# EAGLE design ARDUINO_3V_TTL_INTERFACE_2_PI (EAGLE 9.3.1)
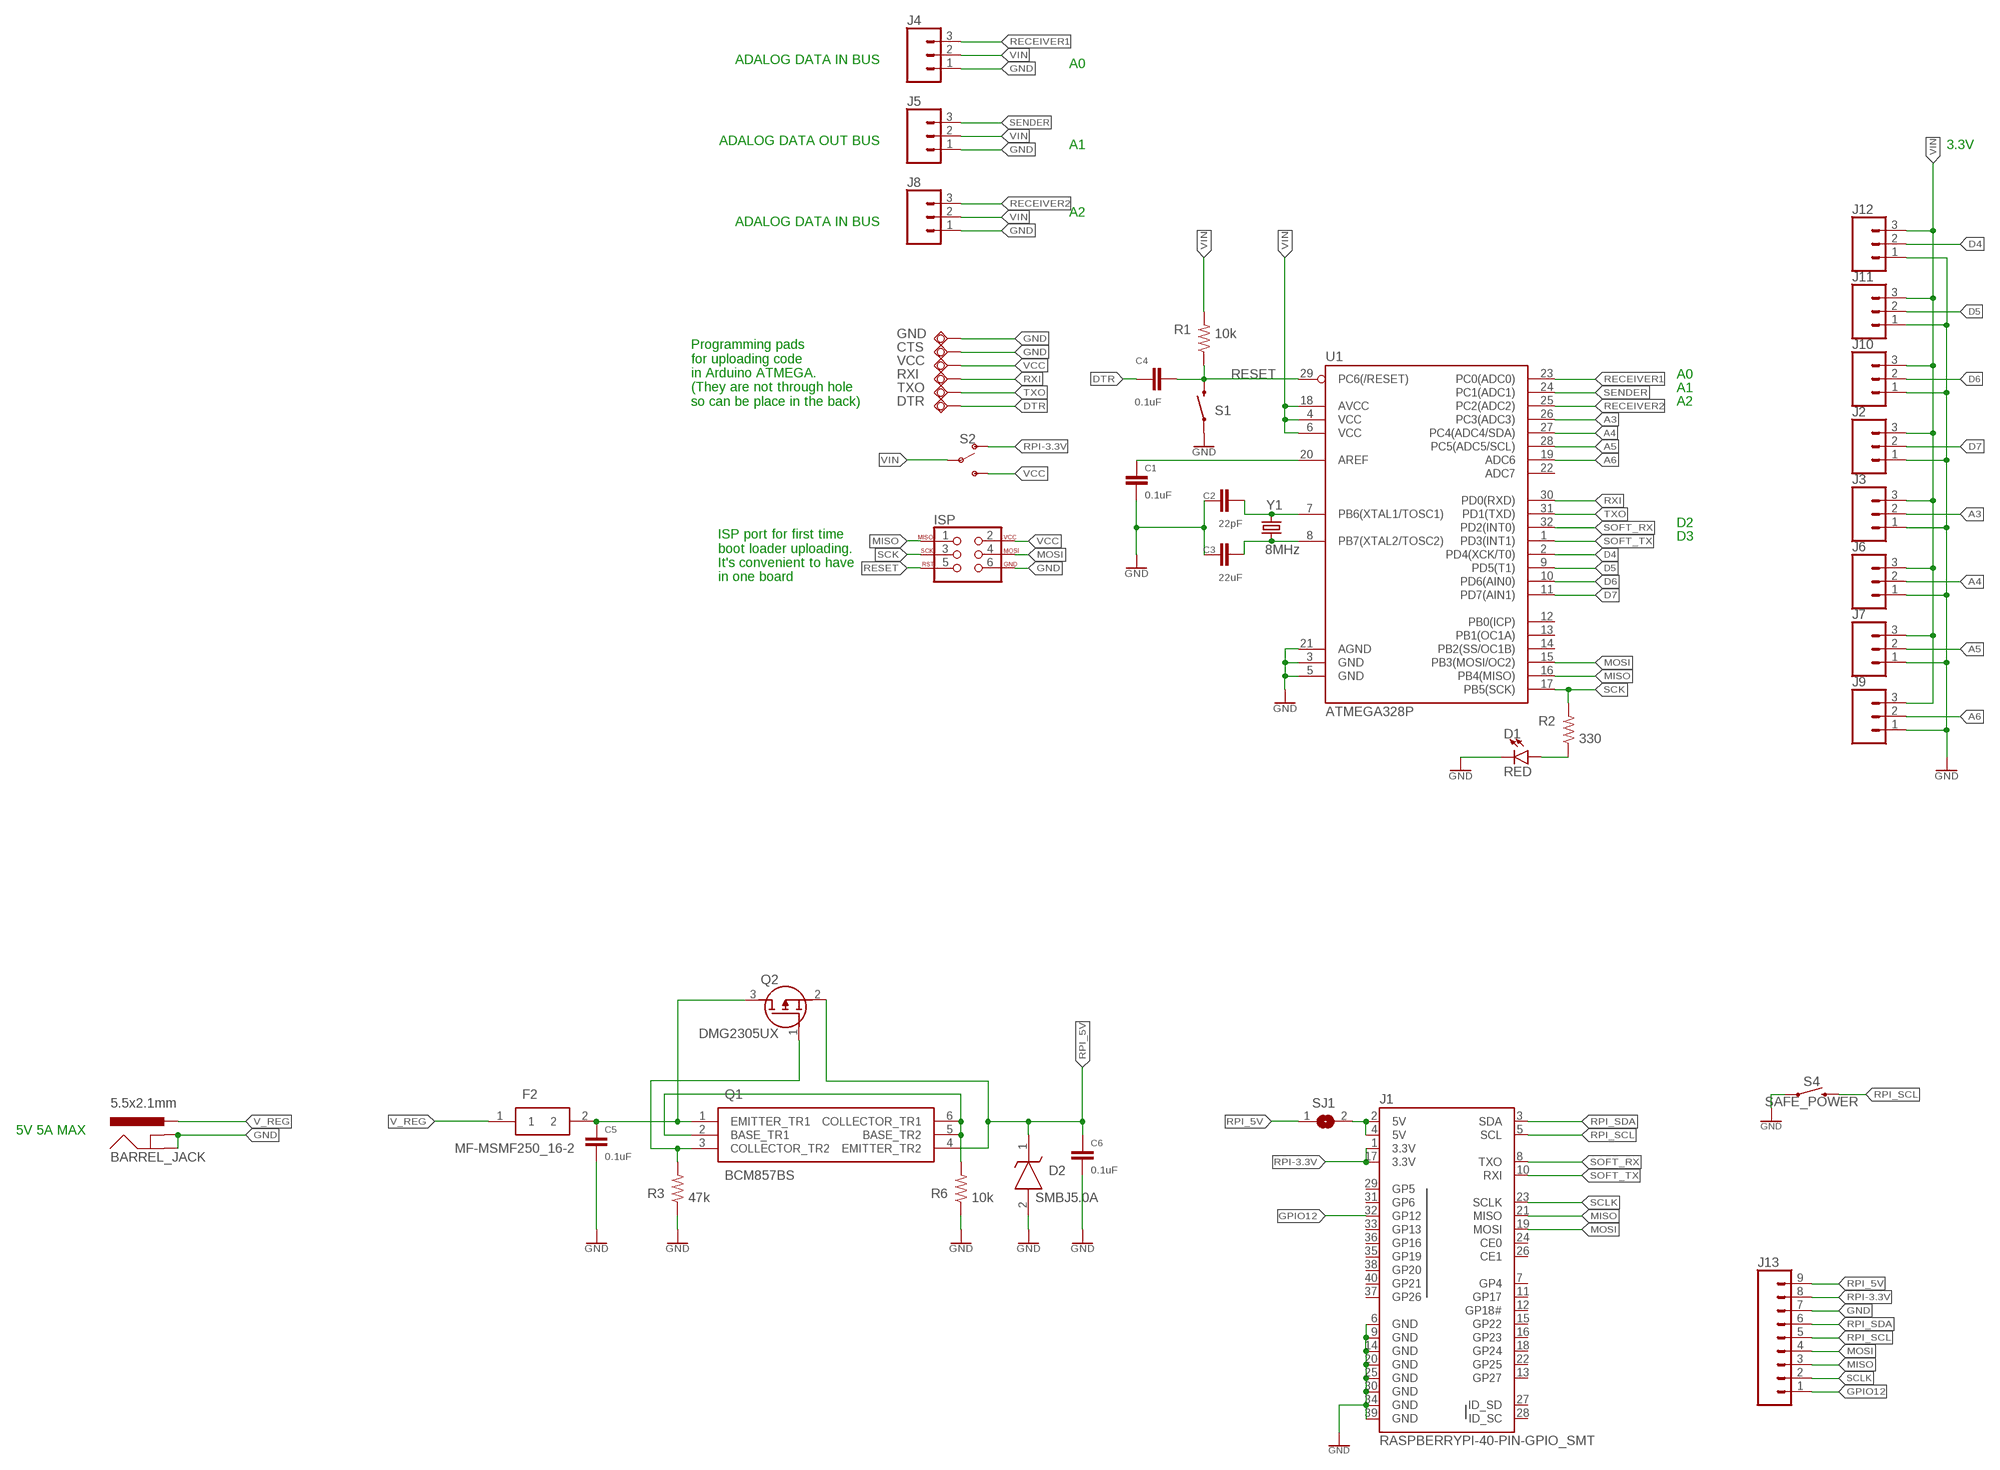
[diagram p0: schematic, sheet 1]

## Parts
BARREL_JACK  5.5x2.1mm  POWER_JACKSMD  [POWER_JACK_SMD]
C1  0.1uF  0.1UF-0603-100V-10%  [0603]
C2  22pF  0.1UF-0603-100V-10%  [0603]
C3  22uF  0.1UF-0603-100V-10%  [0603]
C4  0.1uF  0.1UF-0603-100V-10%  [0603]
C5  0.1uF  0.1UF-0603-100V-10%  [0603]
C6  0.1uF  0.1UF-0603-100V-10%  [0603]
CTS  TPSQB1,27  [B1,27]
D1  RED  LED-GREEN0603  [LED-0603]
D2  SMBJ5.0A  SMBJ5.0A-E3_52  [DIOM5436X244N]
DTR  TPSQB1,27  [B1,27]
F2  MF-MSMF250_16-2  [FUSC4632X160N]
GND  TPSQB1,27  [B1,27]
ISP  AVR_SPI_PROG_3X2NS  [2X3-NS]
J1  RASPBERRYPI-40-PIN-GPIO_SMT  [2X20_SHROUDED_SMT]
J2  CONN_03  [1X03]
J3  CONN_03  [1X03]
J4  CONN_03SMD  [1X03-1MM-RA]
J5  CONN_03SMD  [1X03-1MM-RA]
J6  CONN_03  [1X03]
J7  CONN_03  [1X03]
J8  CONN_03SMD  [1X03-1MM-RA]
J9  CONN_03  [1X03]
J10  CONN_03  [1X03]
J11  CONN_03  [1X03]
J12  CONN_03  [1X03]
J13  CONN_09  [1X09]
Q1  BCM857BS  [SOT65P210X110-6N]
Q2  DMG2305UX  DMG2305UXQ-7  [SOT96P240X102-3N]
R1  10k  10KOHM-0603-1/10W-1%  [0603]
R2  330  10KOHM-0603-1/10W-1%  [0603]
R3  47k  10KOHM-0603-1/10W-1%  [0603]
R6  10k  10KOHM-0603-1/10W-1%  [0603]
RXI  TPSQB1,27  [B1,27]
S1  RESET  MOMENTARY-SWITCH-SPST-SMD-4.6X2.8MM  [TACTILE_SWITCH_SMD_4.6X2.8MM]
S2  SWITCH-SPDT-SMD-RIGHT-ANGLE  [SWITCH_SPST_SMD_A]
S4  SAFE_POWER  MOMENTARY-SWITCH-SPST-PTH-12MM  [TACTILE_SWITCH_PTH_12MM]
SJ1  SJ  [SJ]
TXO  TPSQB1,27  [B1,27]
U1  ATMEGA328P  ATMEGA328P_TQFP  [TQFP32-08]
VCC  TPSQB1,27  [B1,27]
Y1  8MHz  CRYSTAL-8MHZSMD-HC49UP  [HC49UP]

## Nets
A3: J3.2 U1.26(PC3(ADC3))
A4: J6.2 U1.27(PC4(ADC4/SDA))
A5: J7.2 U1.28(PC5(ADC5/SCL))
A6: J9.2 U1.19(ADC6)
D4: J12.2 U1.2(PD4(XCK/T0))
D5: J11.2 U1.9(PD5(T1))
D6: J10.2 U1.10(PD6(AIN0))
D7: J2.2 U1.11(PD7(AIN1))
DTR: C4.1 DTR.TP
GND: BARREL_JACK.GND(GNDBREAK) BARREL_JACK.P$4(GND) C1.2 C2.1 C3.1 C5.2 C6.2 CTS.TP D1.C D2.2(A) GND.TP ISP.6 J1.6(GND) J1.9(GND) J1.14(GND) J1.20(GND) J1.25(GND) J1.30(GND) J1.34(GND) J1.39(GND) J2.1 J3.1 J4.1 J5.1 J6.1 J7.1 J8.1 J9.1 J10.1 J11.1 J12.1 J13.7 R3.1 R6.1 S1.1 S1.2 S4.1 U1.3(GND) U1.5(GND) U1.21(AGND)
GPIO12: J1.32(GP12) J13.1
MISO: ISP.1 J1.21(MISO) J13.3 U1.16(PB4(MISO))
MOSI: ISP.4 J1.19(MOSI) J13.4 U1.15(PB3(MOSI/OC2))
N$1: C1.1 U1.20(AREF)
N$2: J1.2(5V) J1.4(5V) SJ1.2
N$3: D1.A R2.1
N$4: Q1.3(COLLECTOR_TR2) Q2.1(G) R3.2
N$6: Q1.2(BASE_TR1) Q1.5(BASE_TR2) Q1.6(COLLECTOR_TR1) R6.2
N$7: C2.2 U1.7(PB6(XTAL1/TOSC1)) Y1.2
N$8: C3.2 U1.8(PB7(XTAL2/TOSC2)) Y1.1
RECEIVER1: J4.3 U1.23(PC0(ADC0))
RECEIVER2: J8.3 U1.25(PC2(ADC2))
RESET: C4.2 ISP.5 R1.1 S1.3 S1.4 U1.29(PC6(/RESET))
RPI-3.3V: J1.1(3.3V) J1.17(3.3V) J13.8 S2.1(O)
RPI_5V: C6.1 D2.1(K) J13.9 Q1.4(EMITTER_TR2) Q2.2(S) SJ1.1
RPI_SCL: J1.5(SCL) J13.5 S4.3
RPI_SDA: J1.3(SDA) J13.6
RXI: RXI.TP U1.30(PD0(RXD))
SCK: ISP.3 R2.2 U1.17(PB5(SCK))
SCLK: J1.23(SCLK) J13.2
SENDER: J5.3 U1.24(PC1(ADC1))
SOFT_RX: J1.8(TXO) U1.32(PD2(INT0))
SOFT_TX: J1.10(RXI) U1.1(PD3(INT1))
TXO: TXO.TP U1.31(PD1(TXD))
V_REG: BARREL_JACK.VIN0(PWR) C5.1 F2.1 F2.2 Q1.1(EMITTER_TR1) Q2.3(D)
VCC: ISP.2 S2.3(S) VCC.TP
VIN: J2.3 J3.3 J4.2 J5.2 J6.3 J7.3 J8.2 J9.3 J10.3 J11.3 J12.3 R1.2 S2.2(P) U1.4(VCC) U1.6(VCC) U1.18(AVCC)
Unconnected: J1.7(GP4) J1.11(GP17) J1.12(GP18#) J1.13(GP27) J1.15(GP22) J1.16(GP23) J1.18(GP24) J1.22(GP25) J1.24(CE0) J1.26(CE1) J1.27(ID_SD) J1.28(ID_SC) J1.29(GP5) J1.31(GP6) J1.33(GP13) J1.35(GP19) J1.36(GP16) J1.37(GP26) J1.38(GP20) J1.40(GP21) U1.12(PB0(ICP)) U1.13(PB1(OC1A)) U1.14(PB2(SS/OC1B)) U1.22(ADC7)

## Notes on the sheet
- ADALOG DATA IN BUS
- A0
- ADALOG DATA OUT BUS
- A1 | 3.3V
- ADALOG DATA IN BUS | A2
- A0
- A1
- Programming pads
  for uploading code
  in Arduino ATMEGA.
  (They are not through hole
  so can be place in the back)
- A2
- D2
- D3
- ISP port for first time
  boot loader uploading.
  It's convenient to have
  in one board
- 5V 5A MAX

## Library data of the parts
BARREL_JACK = 3-5-pin-smd:POWER_JACK: Power Jack Connector This is the standard 5.5mm barrel jack for power. The PTH is the most common, proven, reliable, footprint. The Slot footprint only works if the mill layer is transmitted to the PCB fab house so be warned. Here are the connectors we sell at SparkFun: DC Barrel Power Jack/Connector <https://www.sparkfun.com/products/119> (PRT-00119) DC Barrel Power Jack/Connector (SMD) <https://www.sparkfun.com/products/12748> (PRT-12748) DC Barrel Jack Adapter - Breadboard Compatible <https://www.sparkfun.com/products/10811> (PRT-10811) It is used on this SparkFun product (and many, many others): SparkFun RedBoard - Programmed with Arduino <https://www.sparkfun.com/products/12757> (DEV-12757) Also, if you need a mating power supply or connector, please check these out: Wall Adapter Power Supply - 9VDC 650mA <https://www.sparkfun.com/products/298> (TOL-00298) DC Barrel Jack Adapter - Male <https://www.sparkfun.com/products/10287> (PRT-10287); PROD_ID: CONN-08106; SF_ID: PRT-12748; VALUE: 5.5x2.1mm Barrel
C1 C4-C6 = SparkFun-Capacitors:0.1UF: 0.1µF ceramic capacitors A capacitor is a passive two-terminal electrical component used to store electrical energy temporarily in an electric field.; PROD_ID: CAP-08390
C2 C3 = SparkFun-Capacitors:0.1UF: 0.1µF ceramic capacitors A capacitor is a passive two-terminal electrical component used to store electrical energy temporarily in an electric field.; PROD_ID: CAP-08390; VALUE: 0.1uF
CTS DTR GND RXI TXO VCC = testpad:TPSQ: Test pad
D1 = SparkFun-LED:LED-GREEN: Green SMD LED Used in manufacturing of various products at SparkFun Packages: 0603 - SMD 0603 package [Product Link] <http://www.futureelectronics.com/en/technologies/semiconductors/optoelectronics/leds/Pages/9894312-LTST-C190GKT.aspx?CrossPart=HSMG-C190&IM=0> LilyPad 1206 - SMD1206 LilyPad package [Product Link] <http://www.futureelectronics.com/en/Technologies/Product.aspx?ProductID=IN150NGHARVATEKCORPORATION2049943&IM=0> 1206 - SMD1206 package [Product Link] <http://www.futureelectronics.com/en/technologies/semiconductors/optoelectronics/leds/Pages/8315665-LTST-C150KGKT.aspx?IM=0> 1206 Bottom Mount -SMD 1206 Bottom Mount [Product Link] <http://www.digikey.com/product-detail/en/lite-on-inc/LTST-C230KGKT/160-1456-1-ND/386854> SparkFun Products: Pro Mini 328 -5V <https://www.sparkfun.com/products/821> RedBoard <https://www.sparkfun.com/products/12757> MP3 Trigger <https://www.sparkfun.com/products/13720> Makey Makey <https://www.sparkfun.com/products/11076>; PROD_ID: DIO-00821; VALUE: GREEN
D2 = SMBJ5.0A-E3_52:SMBJ5.0A-E3_52: Vishay SMBJ5.0A-E3/52, Uni-Directional TVS Diode, 600W, 2-Pin DO-214AA Source: Datasheet <https://www.vishay.com/docs/88392/smbj.pdf>; ALLIED_NUMBER: 70217303; ALLIED_PRICE-STOCK: https://www.alliedelec.com/generalsemiconductor-vishay-smbj5-0a-e3-52/70217303/; DESCRIPTION: Vishay SMBJ5.0A-E3/52, Uni-Directional TVS Diode, 600W, 2-Pin DO-214AA; HEIGHT: 2.44mm; MANUFACTURER_NAME: Vishay; MANUFACTURER_PART_NUMBER: SMBJ5.0A-E3/52; MOUSER_PART_NUMBER: 625-SMBJ5.0A-E3; MOUSER_PRICE-STOCK: https://www.mouser.com/Search/Refine.aspx?Keyword=625-SMBJ5.0A-E3; RS_PART_NUMBER: 1652507; RS_PRICE-STOCK: http://uk.rs-online.com/web/p/products/1652507
F2 = MF-MSMF250_16-2:MF-MSMF250_16-2: BOURNS - MF-MSMF250/16-2 - FUSE, RESETTABLE PTC, 16V, 2.5A, 1812 Source: Datasheet <http://www.mouser.com/datasheet/2/54/fmsmf-772347.pdf>; DESCRIPTION: BOURNS - MF-MSMF250/16-2 - FUSE, RESETTABLE PTC, 16V, 2.5A, 1812; HEIGHT: 1.6mm; MANUFACTURER_NAME: Bourns; MANUFACTURER_PART_NUMBER: MF-MSMF250/16-2; MOUSER_PART_NUMBER: 652-MF-MSMF250/16-2
ISP = SparkFun-Connectors:AVR_SPI_PROG_3X2: AVR ISP 6 Pin This is the reduced ISP connector for AVR programming. Common on Arduino. This footprint will take up less PCB space and can be used with a 10-pin to 6-pin adapter such as SKU: BOB-08508 **Special note about "TEST_POINT" package. The stop mask is on the top side, so if you want your programming test points to be on the bottom of your board, make sure to place this package on the bottom side of the board. This also ensure that the orientation to program from the bottom side will be correct. SparkFun Products: SparkFun ISP Pogo Adapter <https://www.sparkfun.com/products/11591> - NS Tiny AVR Programmer <https://www.sparkfun.com/products/11801> -PTH
J1 = SparkFun-Connectors:RASPBERRYPI-40-PIN-GPIO: Raspberry Pi GPIO Header 2x20 pin connector, as found on B, B+, A+ models. Both shrouded PTH and SMT versions available. SparkFun Products: GPIO Shrouded Header <https://www.sparkfun.com/products/13054>- PTH SparkFun Pi Wedge (Preassembled) <https://www.sparkfun.com/products/13717>; PROD_ID: CONN-13143
J2-J12 = SparkFun-Connectors:CONN_03: Multi connection point. Often used as Generic Header-pin footprint for 0.1 inch spaced/style header connections On any of the 0.1 inch spaced packages, you can populate with these: Break Away Headers - Straight <https://www.sparkfun.com/products/116> (PRT-00116) Break Away Male Headers - Right Angle <https://www.sparkfun.com/products/553> (PRT-00553) Female Headers <https://www.sparkfun.com/products/115> (PRT-00115) Break Away Headers - Machine Pin <https://www.sparkfun.com/products/117> (PRT-00117) Break Away Female Headers - Swiss Machine Pin <https://www.sparkfun.com/products/743> (PRT-00743) Stackable Header - 3 Pin (Female, 0.1") <https://www.sparkfun.com/products/13875> (PRT-13875) For SCREWTERMINALS and SPRING TERMINALS visit here: Screw Terimnals on SparkFun.com <https://www.sparkfun.com/search/results?term=Screw+Terminals> (5mm/3.5mm/2.54mm spacing) This device is also useful as a general connection point to wire up your design to another part of your project. Our various solder wires solder well into these plated through hole pads. Hook-Up Wire - Assortment (Stranded, 22 AWG) <https://www.sparkfun.com/products/11375> (PRT-11375) Hook-Up Wire - Assortment (Solid Core, 22 AWG) <https://www.sparkfun.com/products/11367> (PRT-11367) View the entire wire category on our website here <https://www.sparkfun.com/categories/141> Special notes: Molex polarized connector foot print use with SKU : PRT-08232 with associated crimp pins and housings.
J13 = SparkFun-Connectors:CONN_09: Multi connection point. Often used as Generic Header-pin footprint for 0.1 inch spaced/style header connections On any of the 0.1 inch spaced packages, you can populate with these: Break Away Headers - Straight <https://www.sparkfun.com/products/116> (PRT-00116) Break Away Male Headers - Right Angle <https://www.sparkfun.com/products/553> (PRT-00553) Female Headers <https://www.sparkfun.com/products/115> (PRT-00115) Break Away Headers - Machine Pin <https://www.sparkfun.com/products/117> (PRT-00117) Break Away Female Headers - Swiss Machine Pin <https://www.sparkfun.com/products/743> (PRT-00743) For SCREWTERMINALS and SPRING TERMINALS visit here: Screw Terimnals on SparkFun.com <https://www.sparkfun.com/search/results?term=Screw+Terminals> (5mm/3.5mm/2.54mm spacing) This device is also useful as a general connection point to wire up your design to another part of your project. Our various solder wires solder well into these plated through hole pads. Hook-Up Wire - Assortment (Stranded, 22 AWG) <https://www.sparkfun.com/products/11375> (PRT-11375) Hook-Up Wire - Assortment (Solid Core, 22 AWG) <https://www.sparkfun.com/products/11367> (PRT-11367) View the entire wire category on our website here <https://www.sparkfun.com/categories/141> Special notes: Molex polarized connector foot print use with SKU : PRT-08231 with associated crimp pins and housings. 1MM SMD Version SKU: PRT-10208 NOTES ON THE VARIANTS LOCK and LOCK_LONGPADS... This footprint was designed to help hold the alignment of a through-hole component (i.e. 6-pin header) while soldering it into place. You may notice that each hole has been shifted either up or down by 0.005 of an inch from it's more standard position (which is a perfectly straight line). This slight alteration caused the pins (the squares in the middle) to touch the edges of the holes. Because they are alternating, it causes a "brace" to hold the component in place. 0.005 has proven to be the perfect amount of "off-center" position when using our standard breakaway headers. Although looks a little odd when you look at the bare footprint, once you have a header in there, the alteration is very hard to notice. Also,if you push a header all the way into place, it is covered up entirely on the bottom side.
Q1 = BCM857BS:BCM857BS: NEXPERIA - BCM857BS - TRANSISTOR, MATCHED, SOT-363 Source: Datasheet <https://assets.nexperia.com/documents/data-sheet/BCM857BV_BS_DS.pdf>; DESCRIPTION: NEXPERIA - BCM857BS - TRANSISTOR, MATCHED, SOT-363; HEIGHT: 1.1mm; MANUFACTURER_NAME: Nexperia; MANUFACTURER_PART_NUMBER: BCM857BS; MOUSER_PART_NUMBER: N/A; MOUSER_PRICE-STOCK: https://www.mouser.com/Search/Refine.aspx?Keyword=N%2FA
Q2 = DMG2305UXQ-7:DMG2305UXQ-7: MOSFET MOSFET BVDSS Source: Datasheet <https://componentsearchengine.com/Datasheets/1/DMG2305UXQ-7.pdf>; DESCRIPTION: MOSFET MOSFET BVDSS; HEIGHT: 1.025mm; MANUFACTURER_NAME: Diodes Inc.; MANUFACTURER_PART_NUMBER: DMG2305UXQ-7; MOUSER_PART_NUMBER: 621-DMG2305UXQ-7; MOUSER_PRICE-STOCK: https://www.mouser.com/Search/Refine.aspx?Keyword=621-DMG2305UXQ-7
R1 R6 = SparkFun-Resistors:10KOHM: 10kΩ resistor A resistor is a passive two-terminal electrical component that implements electrical resistance as a circuit element. Resistors act to reduce current flow, and, at the same time, act to lower voltage levels within circuits. - Wikipedia; PROD_ID: RES-00824
R2 R3 = SparkFun-Resistors:10KOHM: 10kΩ resistor A resistor is a passive two-terminal electrical component that implements electrical resistance as a circuit element. Resistors act to reduce current flow, and, at the same time, act to lower voltage levels within circuits. - Wikipedia; PROD_ID: RES-00824; VALUE: 10k
S1 = SparkFun-Switches:MOMENTARY-SWITCH-SPST: Momentary Switch (Pushbutton) - SPST Normally-open (NO) SPST momentary switches (buttons, pushbuttons). Variants PTH-12MM - 12mm square, through-hole Momentary Pushbutton Switch - 12mm Square <https://www.sparkfun.com/products/9190> (COM-09190) PTH-6.0MM, PTH-6.0MM-KIT - 6.0mm square, through-hole Mini Pushbutton Switch <https://www.sparkfun.com/products/97> (COM-00097) KIT package intended for soldering kit's - only one side of pads' copper is exposed. PTH-RIGHT-ANGLE-KIT - Right-angle, through-hole Right Angle Tactile Button <https://www.sparkfun.com/products/10791> - Used on SparkFun BigTime Watch Kit <https://www.sparkfun.com/products/11734> SMD-12MM - 12mm square, surface-mount Tactile Button - SMD (12mm) <https://www.sparkfun.com/products/12993> (COM-12993) Used on SparkFun PicoBoard <https://www.sparkfun.com/products/11888> SMD-4.5MM - 4.5mm Square Trackball Switch Used on SparkFun Blackberry Trackballer Breakout <https://www.sparkfun.com/products/13169> SMD-4.6MMX2.8MM - 4.60mm x 2.80mm, surface mount Used on SparkFun SAMD21 Mini Breakout <https://www.sparkfun.com/products/13664> SMD-5.2MM, SMD-5.2-REDUNDANT - 5.2mm square, surface-mount Mini Pushbutton Switch - SMD <https://www.sparkfun.com/products/8720> (COM-08720) Used on Arduino Pro Mini <https://www.sparkfun.com/products/11114> REDUNDANT package connects both switch circuits together SMD-6.0X3.5MM - 6.0 x 3.5mm, surface mount Momentary Reset Switch SMD <https://www.sparkfun.com/products/8229> (COM-08229) SMD-6.2MM-TALL - 6.2mm square, surface mount Tactile Button - SMD (6mm) <https://www.sparkfun.com/products/12992> Used on SparkFun Digital Sandbox <https://www.sparkfun.com/products/12651> SMD-RIGHT-ANGLE - Right-angle, surface mount Used on SparkFun Block for Intel® Edison - Arduino <https://www.sparkfun.com/products/13036>; PROD_ID: SWCH-13065
S2 = SparkFun-Switches:SWITCH-SPDT: Single Pole, Double Throw (SPDT) Switch Single-pole, double-throw (SPDT) switch. Variant Overview SMD-AYZ0202 Surface Mount DPDT Switch <https://www.sparkfun.com/products/597> (COM-00597) Used on e.g. LilyPad Arduino USB - ATmega32U4 Board <https://www.sparkfun.com/products/12049> PTH-11.6X4.0MM SPDT Mini Power Switch <https://www.sparkfun.com/products/102> (COM-00102) Used on e.g. SparkFun Simon Says - Through-Hole Soldering Kit <https://www.sparkfun.com/products/10547> (KIT-10547) PTH-11.6X4.0MM-KIT KIT version of SPDT Mini Power Switch - Simplifies soldering by removing tStop of switch pins - only one side can be soldered. PTH-11.6X4.0MM-LOCK LOCK version of SPDT Mini Power Switch - Offset pins hold switch in place for easier soldering. SMD-RIGHT-ANGLE Surface Mount Right Angle Switch <https://www.sparkfun.com/products/10860> (COM-10860) Used on e.g. SparkFun ESP8266 Thing <https://www.sparkfun.com/products/13231>; PROD_ID: SWCH-10651; SF_SKU: COM-10860
S4 = SparkFun-Switches:MOMENTARY-SWITCH-SPST: Momentary Switch (Pushbutton) - SPST Normally-open (NO) SPST momentary switches (buttons, pushbuttons). Variants PTH-12MM - 12mm square, through-hole Momentary Pushbutton Switch - 12mm Square <https://www.sparkfun.com/products/9190> (COM-09190) PTH-6.0MM, PTH-6.0MM-KIT - 6.0mm square, through-hole Mini Pushbutton Switch <https://www.sparkfun.com/products/97> (COM-00097) KIT package intended for soldering kit's - only one side of pads' copper is exposed. PTH-RIGHT-ANGLE-KIT - Right-angle, through-hole Right Angle Tactile Button <https://www.sparkfun.com/products/10791> - Used on SparkFun BigTime Watch Kit <https://www.sparkfun.com/products/11734> SMD-12MM - 12mm square, surface-mount Tactile Button - SMD (12mm) <https://www.sparkfun.com/products/12993> (COM-12993) Used on SparkFun PicoBoard <https://www.sparkfun.com/products/11888> SMD-4.5MM - 4.5mm Square Trackball Switch Used on SparkFun Blackberry Trackballer Breakout <https://www.sparkfun.com/products/13169> SMD-4.6MMX2.8MM - 4.60mm x 2.80mm, surface mount Used on SparkFun SAMD21 Mini Breakout <https://www.sparkfun.com/products/13664> SMD-5.2MM, SMD-5.2-REDUNDANT - 5.2mm square, surface-mount Mini Pushbutton Switch - SMD <https://www.sparkfun.com/products/8720> (COM-08720) Used on Arduino Pro Mini <https://www.sparkfun.com/products/11114> REDUNDANT package connects both switch circuits together SMD-6.0X3.5MM - 6.0 x 3.5mm, surface mount Momentary Reset Switch SMD <https://www.sparkfun.com/products/8229> (COM-08229) SMD-6.2MM-TALL - 6.2mm square, surface mount Tactile Button - SMD (6mm) <https://www.sparkfun.com/products/12992> Used on SparkFun Digital Sandbox <https://www.sparkfun.com/products/12651> SMD-RIGHT-ANGLE - Right-angle, surface mount Used on SparkFun Block for Intel® Edison - Arduino <https://www.sparkfun.com/products/13036>; PROD_ID: SWCH-09185; SF_SKU: COM-09190
SJ1 = jumper:SJ: SMD solder JUMPER
U1 = SparkFun-IC-Microcontroller:ATMEGA328P_TQFP: Popular 328P in QFP Storefront component: ATmega328 - TQFP <https://www.sparkfun.com/products/13448> (COM-13448) Datasheet <http://www.sparkfun.com/datasheets/Components/SMD/ATMega328.pdf> SparkFun Products SparkFun RedBoard - Programmed with Arduino <https://www.sparkfun.com/products/12757> (DEV-12757) Arduino Pro Mini 328 - 5V/16MHz <https://www.sparkfun.com/products/11113> (DEV-11113) Arduino Pro Mini 328 - 3.3V/8MHz <https://www.sparkfun.com/products/11114> (DEV-11114) SparkFun OpenLog <https://www.sparkfun.com/products/13712> (DEV-13712) SparkFun MicroView - OLED Arduino Module <https://www.sparkfun.com/products/12923> (DEV-12923) SparkFun Digital Sandbox <https://www.sparkfun.com/products/12651> (DEV-12651) SparkFun PicoBoard <https://www.sparkfun.com/products/11888> (WIG-11888) Arduino Fio <https://www.sparkfun.com/products/10116> (DEV-10116) LilyPad Arduino 328 Main Board <https://www.sparkfun.com/products/13342> (DEV-13342) SparkFun RedStick <https://www.sparkfun.com/products/13741> (DEV-13741) LilyPad MP3 <https://www.sparkfun.com/products/11013> (DEV-11013) LilyPad Arduino SimpleSnap <https://www.sparkfun.com/products/10941> (DEV-10941) SparkFun Stepoko <https://www.sparkfun.com/products/13899> (ROB-13899) SparkFun Geiger Counter <https://www.sparkfun.com/products/11345> (SEN-11345) SparkFun EL Sequencer <https://www.sparkfun.com/products/12781> (COM-12781) Arduino Pro 328 - 5V/16MHz <https://www.sparkfun.com/products/10915> (DEV-10915) CryptoCape <https://www.sparkfun.com/products/12773> (DEV-12773) SparkFun IR Thermometer Evaluation Board - MLX90614 <https://www.sparkfun.com/products/10740> (SEN-10740) SparkFun RedBot Mainboard <https://www.sparkfun.com/products/12097> (ROB-12097) Arduino Pro 328 - 3.3V/8MHz <https://www.sparkfun.com/products/10914> (DEV-10914) SparkFun Block for Intel® Edison - Arduino <https://www.sparkfun.com/products/13036> (DEV-13036) SparkFun Simon Says - Surface Mount Soldering Kit <https://www.sparkfun.com/products/10935> (KIT-10935) SparkFun 7-Segment Serial Display - Red <https://www.sparkfun.com/products/11441> (COM-11441) SparkFun 7-Segment Serial Display - White <https://www.sparkfun.com/products/11629> (COM-11629) SparkFun 7-Segment Serial Display - Yellow <https://www.sparkfun.com/products/11443> (COM-11443) SparkFun 7-Segment Serial Display - Kelly Green <https://www.sparkfun.com/products/11440> (COM-11440) SparkFun 7-Segment Serial Display - Blue <https://www.sparkfun.com/products/11442> (COM-11442) SparkFun OpenSegment Serial Display - 20mm (Blue) <https://www.sparkfun.com/products/11647> (COM-11647) SparkFun OpenSegment Serial Display - 20mm (Green) <https://www.sparkfun.com/products/11646> (COM-11646) SparkFun OpenSegment Serial Display - 20mm (White) <https://www.sparkfun.com/products/11648> (COM-11648) SparkFun OpenSegment Serial Display - 20mm (Red) <https://www.sparkfun.com/products/11644> (COM-11644) SparkFun OpenSegment Serial Display - 20mm (Yellow) <https://www.sparkfun.com/products/11645> (COM-11645) SparkFun OpenSegment Shield <https://www.sparkfun.com/products/13190> (DEV-13190); PROD_ID: IC-09069; VALUE: ATMEGA328P_TQFP
Y1 = SparkFun-Clocks:CRYSTAL-8MHZ: 8MHz Crystal Datasheet Example <http://www.futureelectronics.com/en/technologies/electromechanical/timing-devices/crystals/Pages/6008189-ABM3B-8.000MHZ-B2-T.aspx?IM=0> Frequency: 8MHz Frequency Tolerance: ±20ppm Load Capacitance: 18pF SparkFun Products: Pro Micro -3.3V/8MHz <https://www.sparkfun.com/products/12587> WAV Trigger <https://www.sparkfun.com/products/13660>; PROD_ID: XTAL-11706

## Board
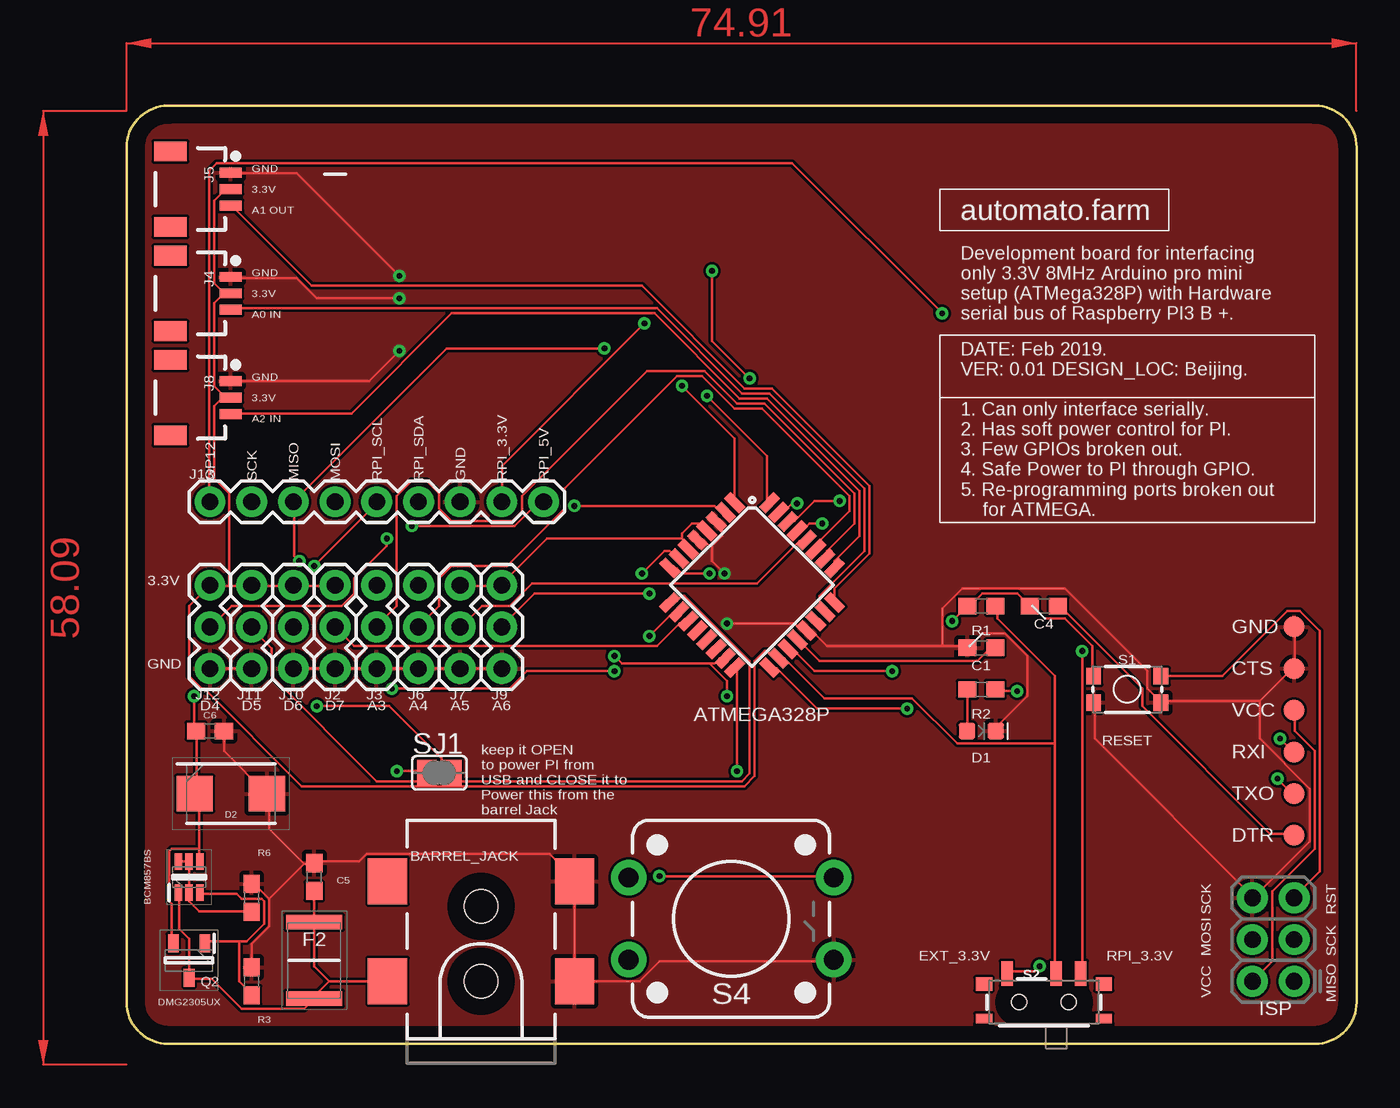
[diagram p1: board, top side]
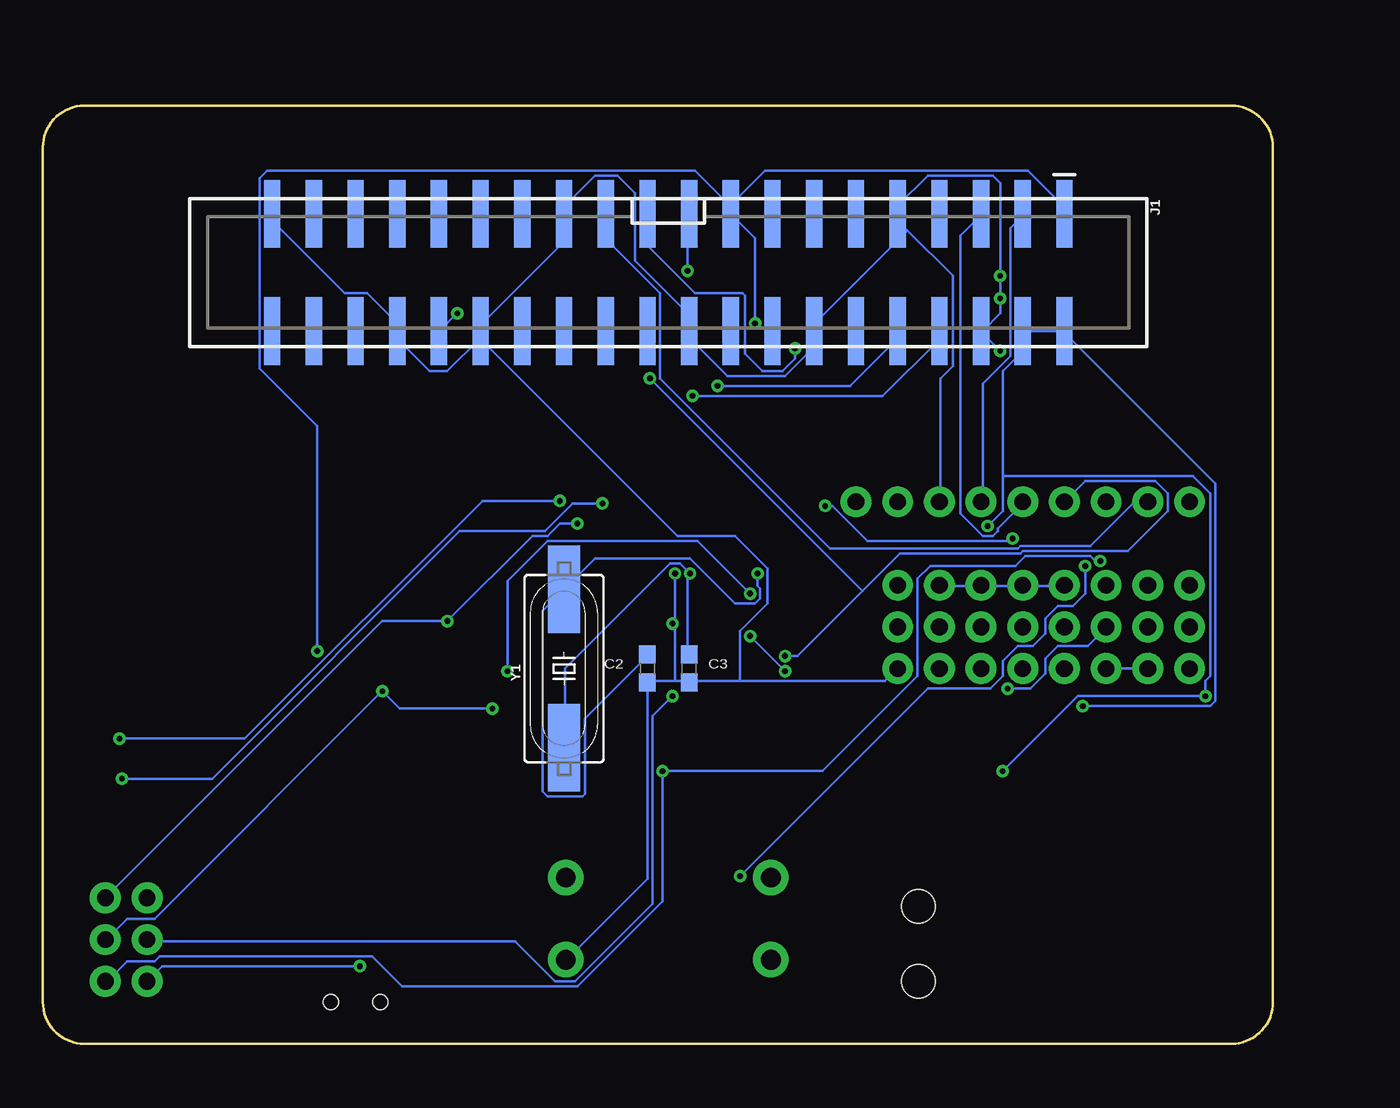
[diagram p2: board, bottom side, seen from below]

Size 74.93 x 57.15 mm. Coordinates in mm from the lower left corner, seen from the top.
Outline: 0,54.61 0,2.54 arc90 2.54,0 72.39,0 arc90 74.93,2.54 74.93,54.61 arc90 72.39,57.15 2.54,57.15 arc90 0,54.61
Copper layers (1*16): Top 0.035mm / dielectric 1.5mm / Bottom 0.035mm
Design rules "default": minimum track width 6mil, minimum drill 0.35mm, track to track 6mil, track to pad 6mil, pad to pad 6mil, via to via 6mil, smd to smd 6mil, copper to edge 40mil, drill to drill 6mil, minimum pad ring 10mil, minimum via ring 8mil, stop-mask expansion 4mil, vias tented up to drill 0mil, thermal gap 10mil

### Footprints (pad centres in the part's own frame; a part is rotated, then mirrored left to right if it is on the bottom)
POWER_JACK_SMD = smd 2.8 x 2.4: GND 0,-5.7; P$4 6.1,-5.7; VIN0 0,5.7; VIN1 6.1,5.7 | hole 2.032: 0,0; 4.572,0
0603 = smd 1.1 x 1: 1 -0.85,0; 2 0.85,0
B1,27 = smd 1.27 x 1.27: TP 0,0
LED-0603 = smd 1 x 1: A -0.877,0; C 0.877,0
DIOM5436X244N = smd 2.2 x 2.15: 1 -2.2,0; 2 2.2,0
FUSC4632X160N = smd 0.89 x 3.43: 1 -2.325,0; 2 2.325,0
2X3-NS = drill 1.016 pad 1.88: 1 -2.54,-1.27; 2 -2.54,1.27; 3 0,-1.27; 4 0,1.27; 5 2.54,-1.27; 6 2.54,1.27
2X20_SHROUDED_SMT = smd 4.14 x 0.991: 1 -3.569,24.13; 2 3.569,24.13; 3 -3.569,21.59; 4 3.569,21.59; 5 -3.569,19.05; 6 3.569,19.05; 7 -3.569,16.51; 8 3.569,16.51; 9 -3.569,13.97; 10 3.569,13.97; 11 -3.569,11.43; 12 3.569,11.43; 13 -3.569,8.89; 14 3.569,8.89; 15 -3.569,6.35; 16 3.569,6.35; 17 -3.569,3.81; 18 3.569,3.81; 19 -3.569,1.27; 20 3.569,1.27; 21 -3.569,-1.27; 22 3.569,-1.27; 23 -3.569,-3.81; 24 3.569,-3.81; 25 -3.569,-6.35; 26 3.569,-6.35; 27 -3.569,-8.89; 28 3.569,-8.89; 29 -3.569,-11.43; 30 3.569,-11.43; 31 -3.569,-13.97; 32 3.569,-13.97; 33 -3.569,-16.51; 34 3.569,-16.51; 35 -3.569,-19.05; 36 3.569,-19.05; 37 -3.569,-21.59; 38 3.569,-21.59; 39 -3.569,-24.13; 40 3.569,-24.13
1X03 = drill 1.016 pad 1.88: 1 0,0; 2 2.54,0; 3 5.08,0
1X03-1MM-RA = smd 0.6 x 1.35: 1 -1,0; 2 0,0; 3 1,0 | smd 1.2 x 2: NC1 2.3,-3.675; NC2 -2.3,-3.675
1X09 = drill 1.016 pad 1.88: 1 0,0; 2 2.54,0; 3 5.08,0; 4 7.62,0; 5 10.16,0; 6 12.7,0; 7 15.24,0; 8 17.78,0; 9 20.32,0
SOT65P210X110-6N = smd 1 x 0.45: 1 -0.95,0.65; 2 -0.95,0; 3 -0.95,-0.65; 4 0.95,-0.65; 5 0.95,0; 6 0.95,0.65
SOT96P240X102-3N = smd 1.1 x 0.65: 1 -1.05,0.96; 2 -1.05,-0.96; 3 1.05,0
TACTILE_SWITCH_SMD_4.6X2.8MM = smd 0.9 x 1: 1 -2.05,-0.8; 2 2.05,-0.8; 3 2.05,0.8; 4 -2.05,0.8
SWITCH_SPST_SMD_A = smd 0.7 x 1.5: 1 -2.25,-1.75; 2 -0.75,-1.75; 3 2.25,-1.75 | smd 1 x 0.6: GND1 -3.65,1; GND3 3.65,1 | smd 1 x 0.8: GND2 -3.65,-1.1; GND4 3.65,-1.1 | hole 0.9: -1.5,0; 1.5,0
TACTILE_SWITCH_PTH_12MM = drill 1.2 pad 2.159: 1 6.25,-2.5; 2 -6.25,-2.5; 3 6.25,2.5; 4 -6.25,2.5
SJ = smd 1.168 x 1.6: 1 -0.762,0; 2 0.762,0
TQFP32-08 = smd 1.27 x 0.559: 1 -4.293,2.8; 2 -4.293,2; 3 -4.293,1.2; 4 -4.293,0.4; 5 -4.293,-0.4; 6 -4.293,-1.2; 7 -4.293,-2; 8 -4.293,-2.8; 17 4.293,-2.8; 18 4.293,-2; 19 4.293,-1.2; 20 4.293,-0.4; 21 4.293,0.4; 22 4.293,1.2; 23 4.293,2; 24 4.293,2.8 | smd 0.559 x 1.27: 9 -2.8,-4.293; 10 -2,-4.293; 11 -1.2,-4.293; 12 -0.4,-4.293; 13 0.4,-4.293; 14 1.2,-4.293; 15 2,-4.293; 16 2.8,-4.293; 25 2.8,4.293; 26 2,4.293; 27 1.2,4.293; 28 0.4,4.293; 29 -0.4,4.293; 30 -1.2,4.293; 31 -2,4.293; 32 -2.8,4.293
HC49UP = smd 5.334 x 1.93: 1 -4.826,0; 2 4.826,0

### Placement (x,y rotation side)
BARREL_JACK  21.59,3.81 90 top
C1  52.07,24.13 180 top
C2  38.1,22.86 90 bottom
C3  35.56,22.86 90 bottom
C4  55.88,26.67 180 top
C5  11.43,10.16 90 top
C6  5.08,19.05 0 top
CTS  71.12,22.86 0 top
D1  52.07,19.05 0 top
D2  6.35,15.24 0 top
DTR  71.12,12.7 0 top
F2  11.43,5.08 90 top
GND  71.12,25.4 0 top
ISP  69.85,6.35 90 top
J1  36.83,46.99 270 bottom
J2  12.7,22.86 90 top
J3  15.24,22.86 90 top
J4  6.35,45.72 270 top
J5  6.35,52.07 270 top
J6  17.78,22.86 90 top
J7  20.32,22.86 90 top
J8  6.35,39.37 270 top
J9  22.86,22.86 90 top
J10  10.16,22.86 90 top
J11  7.62,22.86 90 top
J12  5.08,22.86 90 top
J13  5.08,33.02 0 top
Q1  3.81,10.16 90 top
Q2  3.81,5.08 270 top
R1  52.07,26.67 0 top
R2  52.07,21.59 0 top
R3  7.62,3.81 270 top
R6  7.62,8.89 270 top
RXI  71.12,17.78 0 top
S1  60.96,21.59 0 top
S2  55.88,2.54 180 top
S4  36.83,7.62 0 top
SJ1  19.05,16.51 0 top
TXO  71.12,15.24 0 top
U1  38.1,27.94 315 top
VCC  71.12,20.32 0 top
Y1  43.18,22.86 90 bottom

### Tracks (layer width: path | path; a pad name or v marks a point on that pad's centre or on a via)
A3
  Top 0.152: U1.26 42.67,29.57 42.67,30.02 44.35,31.7 44.35,33.53 38.86,39.01 37.19,39.01 35.2,41 31.7,41 24.08,33.38 24.08,32.46 23.47,31.85 19.81,31.85 19.05,32.61 19.05,33.53 18.29,34.29 17.37,34.29 16.46,33.38 16.46,26.67 15.24,25.45 J3.2
A4
  Top 0.152: J6.2 19.05,26.67 19.05,28.35 19.81,29.11 23.16,29.11 26.67,32.61 26.67,33.83 33.53,40.69 35.05,40.69 37.03,38.71 38.71,38.71 44.04,33.38 44.04,32.46 42.06,30.48 42.06,30.18 U1.27
A5
  Top 0.152: U1.28 41.3,30.63 41,30.63 38.41,28.04 24.69,28.04 23.32,26.67 21.64,26.67 20.42,25.45 J7.2
A6  (via drill 0.35)
  Top 0.152: v46.63,22.71 41.91,22.71 40.69,23.93 40.39,23.93 U1.19 | v31.85,27.43 24.84,27.43 22.86,25.45 J9.2
  Bottom 0.152: v46.63,22.71 46.63,28.19 44.2,30.63 35.05,30.63 v31.85,27.43
D4  (via drill 0.35)
  Top 0.152: v27.28,32.77 35.81,32.77 36.12,32.46 36.42,32.46 U1.2 | v15.85,30.79 15.85,30.33 13.87,28.35 13.87,27.43 13.11,26.67 6.4,26.67 5.18,25.45 J12.2
  Bottom 0.152: v27.28,32.77 26.82,32.77 24.69,30.63 16,30.63 v15.85,30.79
D5
  Top 0.152: U1.9 33.22,26.98 33.53,26.98 33.83,27.28 33.98,27.28 37.95,23.32 37.95,16.46 37.49,16 15.24,16 8.84,22.4 8.84,24.08 7.62,25.3 J11.2
D6  (via drill 0.35)
  Top 0.152: v31.85,24.84 33.22,26.21 33.53,26.21 U1.10 | v29.72,22.71 24.38,22.71 23.32,21.64 v16.15,21.64
  Bottom 0.152: v29.72,22.71 v31.85,24.84 | v16.15,21.64 14.78,21.64 13.87,22.55 13.87,23.47 13.11,24.23 11.28,24.23 10.21,25.3 J10.2
D7
  Top 0.152: J2.2 13.87,24.23 32.31,24.23 33.68,25.6 34.14,25.6 U1.11
DTR
  Top 0.152: C4.1 56.84,26.67 61.87,21.64 61.87,20.57 69.65,12.8 71.02,12.8 DTR.TP
GND  (via drill 0.35)
  Top 0.152: v16.61,42.22 14.78,40.39 6.4,40.39 J8.1 | v16.61,45.41 11.58,45.41 10.36,46.63 6.4,46.63 J4.1 | v16.61,46.79 10.36,53.03 6.4,53.03 J5.1 | 52.12,24.99 53.49,24.99 54.86,23.62 54.86,21.18 53.03,19.36 53.03,19.05 D1.C | 51.36,24.23 C1.2 51.21,24.23 49.68,24.23 | 49.68,24.23 42.67,24.23 41.76,25.15 41.45,25.15 U1.21 41.3,25.3 41,25.3 40.69,25.6 v36.58,25.6 | 69.04,20.88 63.09,20.88 S1.2 62.94,20.88 62.18,21.64 62.18,22.71 57.15,27.74 50.9,27.74 49.68,26.52 49.68,24.23 | 69.04,20.88 71.02,22.86 CTS.TP 71.17,22.86 71.17,25.3 GND.TP | S1.1 58.98,20.73 58.98,18.59 68.58,8.99 ISP.6 68.58,8.84 72.08,12.34 72.08,15.54 69.04,18.59 69.04,20.88 | J11.1 J12.1 | J10.1 J2.1 J3.1 J6.1 J7.1 J9.1 | 35.66,30.33 35.51,30.33 35.2,30.63 34.9,30.63 U1.5 | 35.66,30.33 36.27,30.94 36.27,31.39 35.97,31.7 U1.3 | 35.66,30.33 35.66,29.41 v36.42,28.65 | C6.2 5.94,19.05 5.94,17.83 8.53,15.24 D2.2 8.69,15.24 8.69,13.11 10.82,10.97 | R3.1 7.62,6.1 8.69,7.16 8.69,8.84 | 8.69,8.84 7.92,9.6 7.62,9.6 R6.1 | 10.82,10.97 11.43,10.97 C5.2 11.43,11.12 14.17,11.12 14.63,11.58 25.76,11.58 27.28,10.06 BARREL_JACK.P$4 BARREL_JACK.GND 31.24,3.81 32.46,5.03 42.98,5.03 S4.1 | 8.69,8.84 10.82,10.97
  Bottom 0.152: 48.31,42.98 48.31,43.28 J1.30 | 48.31,42.98 50.29,41 51.36,41 53.34,42.98 J1.34 53.34,43.89 55.17,45.72 56.54,45.72 60.96,50.14 J1.39 | J1.30 48.16,43.43 48.16,43.89 43.28,48.77 43.28,50.44 J1.25 43.13,50.6 43.13,51.05 41.3,52.88 39.93,52.88 38.86,51.82 38.86,47.7 35.66,44.5 35.66,43.43 J1.20 35.51,43.28 35.51,42.98 33.22,40.69 29.72,40.69 28.04,42.37 28.04,43.28 J1.14 27.89,43.43 27.89,43.89 22.25,49.53 | v16.61,42.22 17.68,43.28 J1.6 17.68,43.43 16.61,44.5 v16.61,45.41 v16.61,46.79 16.61,52.43 17.07,52.88 21.03,52.88 22.86,51.05 J1.9 22.86,50.14 22.25,49.53 | 22.25,49.53 19.51,46.79 19.51,41.3 20.27,40.54 20.27,33.07 J13.7 | J10.1 J11.1 | 36.42,22.1 38.1,22.1 C2.1 38.1,10.06 42.98,5.18 S4.1 | 36.42,22.1 35.66,22.1 C3.1 35.51,22.1 32.46,22.1 | 32.46,22.1 23.62,22.1 J9.1 | 36.42,22.1 36.42,25.6 | 36.42,25.6 v36.42,28.65 | 36.42,25.6 v36.58,25.6 | 48.31,42.98 36.27,30.94 32.77,30.94 30.79,28.96 30.79,26.82 32.46,25.15 32.46,22.1 | 48.31,42.98 J1.30
  pour Top: 0,57.15 0,0 1.27,0 74.93,0 74.93,3.81 74.93,57.15
GPIO12  (via drill 0.35)
  Top 0.152: v49.68,44.5 40.54,53.65 5.49,53.65 5.03,53.19 5.03,33.07 J13.1
  Bottom 0.152: v49.68,44.5 50.75,43.43 J1.32
MISO  (via drill 0.35)
  Top 0.152: v37.19,16.61 37.19,22.86 U1.16 | v10.52,29.41 10.21,29.72 10.21,32.92 J13.3 19.51,42.37 v29.11,42.37
  Bottom 0.152: ISP.1 71.02,3.81 69.8,5.03 68.12,5.03 67.82,5.33 54.86,5.33 53.03,3.5 42.37,3.5 37.19,8.69 v37.19,16.61 27.43,16.61 21.64,22.4 21.64,28.35 20.88,29.11 15.7,29.11 15.09,29.72 11.12,29.72 10.82,29.41 v10.52,29.41 | J1.21 38.1,48.62 35.2,45.72 32.31,45.72 32.16,45.57 32.16,42.06 31.09,41 29.87,41 29.11,41.76 v29.11,42.37
MOSI  (via drill 0.35)
  Top 0.152: 35.51,23.16 30.18,23.16 v29.72,23.62 | 35.51,23.16 35.81,23.16 36.12,23.47 36.42,23.47 U1.15 | v36.58,21.18 36.58,22.1 35.51,23.16 | v35.66,47.09 35.66,42.82 v37.95,40.54
  Bottom 0.152: v29.72,23.62 28.96,23.62 24.99,27.58 | 24.99,27.58 22.71,29.87 15.39,29.87 15.24,30.02 8.84,30.02 6.4,32.46 6.4,33.53 7.16,34.29 11.43,34.29 J13.4 | v36.58,21.18 37.8,19.96 37.8,8.53 42.52,3.81 43.74,3.81 46.18,6.25 68.58,6.25 ISP.4 | v35.66,47.09 35.66,50.44 J1.19 | 24.99,27.58 v37.95,40.54
N$1
  Top 0.152: C1.1 52.88,24.08 52.58,24.08 51.82,23.32 42.22,23.32 41,24.54 U1.20
N$2  (via drill 0.35)
  Top 0.152: v11.58,20.57 16,20.57 19.2,17.37 19.2,17.22 19.81,16.61 SJ1.2
  Bottom 0.152: v11.58,20.57 3.81,20.57 3.5,20.88 3.5,34.14 12.65,43.28 J1.2 12.8,43.43 15.24,43.43 J1.4
N$3
  Top 0.152: D1.A 51.21,19.05 51.21,21.49 R2.1
N$4
  Top 0.152: 6.86,6.25 4.88,6.25 Q2.1 | 6.86,6.25 7.32,6.25 8.38,7.32 8.38,8.69 8.23,8.84 7.01,8.84 6.71,9.14 4.57,9.14 Q1.3 | 6.86,6.25 6.86,3.81 7.62,3.05 R3.2
N$6
  Top 0.152: Q1.6 3.2,11.12 3.81,11.12 Q1.5 Q1.2 3.81,8.69 4.42,8.08 7.62,8.08 R6.2
N$7  (via drill 0.35)
  Top 0.152: v31.39,28.65 32.77,30.02 33.07,30.02 33.53,29.57 U1.7
  Bottom 0.152: C2.2 38.1,23.62 41.91,19.81 41.91,15.24 42.06,15.09 44.2,15.09 44.5,15.39 44.5,26.36 Y1.2 41.3,29.57 35.51,29.57 32.77,26.82 31.55,26.82 31.24,27.13 31.24,27.74 31.39,27.89 v31.39,28.65
N$8  (via drill 0.35)
  Top 0.152: v35.51,28.65 33.83,28.65 33.53,28.96 33.22,28.96 U1.8
  Bottom 0.152: 35.66,28.65 35.66,28.8 36.12,29.26 36.73,29.26 43.13,22.86 43.13,18.14 Y1.1 | 35.66,28.65 35.66,23.77 C3.2 | 35.66,28.65 v35.51,28.65
RECEIVER1
  Top 0.152: U1.23 42.52,26.36 42.52,26.67 42.22,26.98 42.22,27.28 44.96,30.02 44.96,33.83 39.17,39.62 37.49,39.62 32.31,44.81 6.4,44.81 J4.3
RECEIVER2
  Top 0.152: U1.25 43.13,29.11 43.13,29.41 44.65,30.94 44.65,33.68 39.01,39.32 37.34,39.32 32.16,44.5 19.81,44.5 13.72,38.41 6.4,38.41 J8.3
RESET  (via drill 0.35)
  Top 0.152: S1.4 58.83,22.4 58.83,24.23 57.15,25.91 55.93,25.91 55.17,26.67 C4.2 55.02,26.67 54.25,27.43 52.12,27.43 51.36,26.67 R1.1 51.21,26.67 v50.29,25.76 | v42.37,31.7 41.6,31.7 41.3,31.39 41,31.39 U1.29 | S1.3 63.09,22.4 66.75,22.4 70.71,26.36 71.48,26.36 72.69,25.15 72.69,10.52 71.17,8.99 ISP.5
  Bottom 0.152: v42.37,31.7 43.43,31.7 44.2,30.94 45.11,30.94 v50.29,25.76 54.25,25.76 ISP.5
RPI-3.3V  (via drill 0.35)
  Top 0.152: v58.22,23.93 58.22,4.42 S2.1 | J13.8 22.86,35.2 v31.55,43.89
  Bottom 0.152: v58.22,23.93 58.22,37.64 61.72,41.15 61.72,52.73 61.27,53.19 35.2,53.19 33.07,51.05 | 33.07,51.05 33.07,50.6 J1.17 | v31.55,43.89 31.55,49.07 32.92,50.44 J1.17 | 33.07,51.05 30.94,53.19 14.94,53.19 12.8,51.05 12.8,50.6 J1.1 | 33.07,51.05 J1.17
RPI_5V  (via drill 0.35)
  Top 0.152: 4.42,11.89 4.42,15.09 4.27,15.24 | 4.42,11.89 4.42,11.12 Q1.4 | 4.42,11.89 2.74,11.89 2.59,11.73 2.59,8.69 2.74,8.53 2.74,6.25 Q2.2 | 4.27,15.24 4.27,19.05 C6.1 4.12,19.05 v4.12,21.18 | 4.27,15.24 D2.1 | v17.37,31.55 23.62,31.55 24.99,32.92 25.3,32.92 J13.9 | v16.46,16.61 18.29,16.61 SJ1.1
  Bottom 0.152: v17.37,31.55 16.46,32.46 16.46,34.59 | 16.46,34.59 16.46,41 15.24,42.22 | 16.46,34.59 4.88,34.59 3.81,33.53 3.81,22.4 4.12,22.1 v4.12,21.18 11.89,21.18 v16.46,16.61
RPI_SCL  (via drill 0.35)
  Top 0.152: v32.46,10.21 42.98,10.21 S4.3 | v11.43,29.11 15.24,32.92 J13.5
  Bottom 0.152: J13.5 15.24,32.92 16.76,31.39 16.76,31.24 17.07,30.94 17.68,30.94 19.05,32.31 19.05,49.23 17.83,50.44 J1.5 | v32.46,10.21 21.03,21.64 17.22,21.64 16.46,22.4 16.46,23.32 15.54,24.23 14.63,24.23 13.87,24.99 13.87,25.91 13.11,26.67 12.19,26.67 11.43,27.43 v11.43,29.11
RPI_SDA
  Bottom 0.152: J13.6 17.68,33.07 17.68,40.23 16,41.91 16,49.68 15.24,50.44 J1.3
RXI  (via drill 0.35)
  Top 0.152: v43.43,33.07 41.91,33.07 40.69,31.85 40.39,31.85 U1.30 | v70.26,18.59 71.02,17.83 RXI.TP
  Bottom 0.152: v43.43,33.07 48.16,33.07 62.64,18.59 v70.26,18.59
SCK  (via drill 0.35)
  Top 0.152: v54.25,21.49 53.03,21.49 R2.2 | v47.55,20.42 42.06,20.42 39.62,22.86 39.17,22.86 U1.17
  Bottom 0.152: ISP.3 71.02,6.4 69.8,7.62 68.12,7.62 v54.25,21.49 53.19,20.42 v47.55,20.42
SCLK
  Bottom 0.152: J13.2 7.62,32.92 8.53,32.92 11.12,30.33 15.39,30.33 15.54,30.18 26.98,30.18 37.34,40.54 37.34,45.72 40.54,48.92 40.54,50.44 J1.23
SENDER
  Top 0.152: U1.24 43.13,26.98 43.13,27.74 45.26,29.87 45.26,33.98 39.32,39.93 37.64,39.93 31.39,46.18 11.28,46.18 6.4,51.05 J5.3
SOFT_RX  (via drill 0.35)
  Top 0.152: v35.36,39.47 39.01,35.81 39.01,33.07 U1.32
  Bottom 0.152: v35.36,39.47 23.77,39.47 20.42,42.82 20.42,43.28 J1.8
SOFT_TX  (via drill 0.35)
  Top 0.152: v33.83,40.08 37.03,36.88 37.03,33.07 U1.1
  Bottom 0.152: v33.83,40.08 25.76,40.08 22.86,42.98 J1.10
TXO  (via drill 0.35)
  Top 0.152: v40.84,32.92 40.54,32.92 40.08,32.46 39.78,32.46 U1.31 | v70.1,16.15 71.02,15.24 TXO.TP
  Bottom 0.152: v40.84,32.92 42.67,32.92 44.35,31.24 49.53,31.24 64.62,16.15 v70.1,16.15
V_REG
  Top 0.152: C5.1 F2.2 11.43,4.72 12.34,3.81 | Q1.1 3.2,9.14 3.2,7.01 3.81,6.4 Q2.3 3.81,3.96 5.18,3.96 7.01,2.13 10.82,2.13 F2.1 11.43,2.9 12.34,3.81 | 12.34,3.81 BARREL_JACK.VIN0
VCC  (via drill 0.35)
  Top 0.152: ISP.2 69.8,5.03 69.8,9.3 72.39,11.89 72.39,17.83 71.17,19.05 71.17,20.27 VCC.TP | v55.63,4.72 55.32,4.42 53.65,4.42 S2.3
  Bottom 0.152: v55.63,4.72 67.67,4.72 ISP.2
VIN
  Top 0.152: 56.54,18.29 56.54,4.42 S2.2 | 56.54,18.29 56.54,22.4 53.03,25.91 53.03,26.67 R1.2 | 56.54,18.29 50.6,18.29 47.85,21.03 42.52,21.03 40.08,23.47 39.78,23.47 U1.18 39.62,23.62 39.32,23.62 39.01,23.93 38.86,23.93 38.25,23.32 38.25,16.31 37.64,15.7 10.67,15.7 4.72,21.64 4.57,21.64 3.81,22.4 3.81,26.67 J12.3 5.18,27.89 6.25,27.89 | 33.83,30.79 34.14,30.48 34.14,30.18 U1.6 | 33.83,30.79 33.83,31.09 34.44,31.7 34.9,31.7 35.2,31.39 U1.4 | 33.83,30.79 25.6,30.79 22.86,28.04 J9.3 22.86,27.89 20.42,27.89 J7.3 | 5.94,39.47 6.25,39.47 J8.2 5.94,39.47 | 5.94,39.47 5.33,40.08 5.33,45.11 5.94,45.72 | 5.94,45.72 J4.2 6.25,45.72 | 5.94,45.72 5.33,46.33 5.33,51.36 5.94,51.97 6.25,51.97 J5.2 | 7.62,27.89 6.25,27.89 | J2.3 12.65,27.89 10.21,27.89 J10.3 10.06,27.89 7.62,27.89 | 7.62,27.89 J11.3 | 5.94,39.47 5.33,38.86 5.33,34.44 6.25,33.53 6.25,27.89
  Bottom 0.152: J7.3 20.27,27.89 17.83,27.89 J6.3 17.68,27.89 15.24,27.89 | 15.24,27.89 12.8,27.89 J2.3 | 15.24,27.89 J3.3
(copper drawn outside any net)
  shapes: Top area x2

### Text on the board
tPlace: GND | 3.3V | A1 OUT | automato.farm | GND | 3.3V | Development board for interfacing / only 3.3V 8MHz Arduino pro mini / setup (ATMega328P) with Hardware / serial bus of Raspberry PI3 B +. | A0 IN | GND | 3.3V | A2 IN | DATE: Feb 2019. / VER: 0.01 DESIGN_LOC: Beijing. / / 1. Can only interface serially. / 2. Has soft power control for PI. / 3. Few GPIOs broken out. / 4. Safe Power to PI through GPIO. / 5. Re-programming ports broken out / for ATMEGA. | GP12 | SCK | MISO | MOSI | RPI_SCL | RPI_SDA | GND | RPI_3.3V | RPI_5V | 3.3V | GND | GND | CTS | D4 | D5 | D6 | D7 | A3 | A4 | A5 | A6 | VCC | RXI | TXO | keep it OPEN / to power PI from / USB and CLOSE it to / Power this from the / barrel Jack | DTR | SCK | RST | EXT_3.3V | RPI_3.3V | MOSI | SCK | VCC | MISO